# Altium schematic sheet Display_4DLCD-35480320-IPS.SchDoc
size A4; SheetNumber: 6; SheetTotal: 6
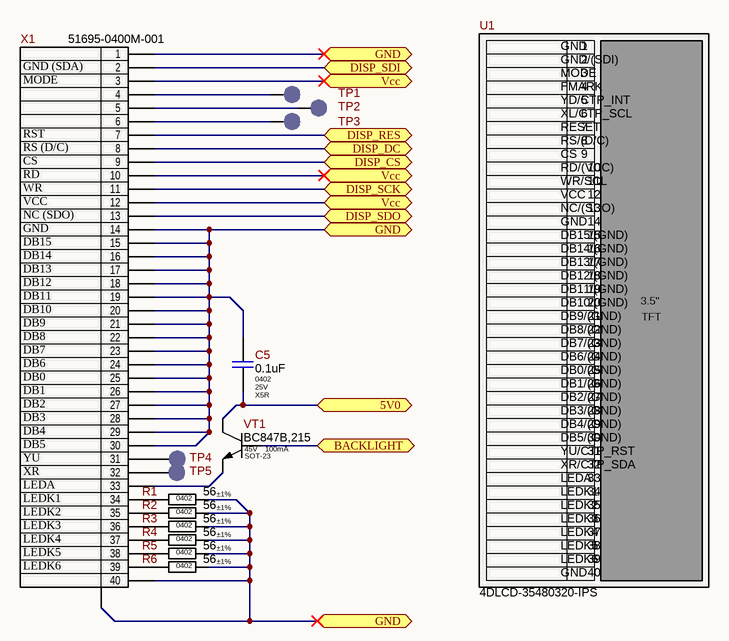
[diagram p0: Display_4DLCD-35480320-IPS.SchDoc]

## Parts
C5  Package: 0402  Voltage: 25V  Dielectric Type: X5R  [C_CERAMIC_0402_HI]  (hidden comment: 0.1uF)
R1  Tolerance: ±1%  Package: 0402  [R_ANY_CHIP_0402_MED]  (hidden comment: 56)
R2  Tolerance: ±1%  Package: 0402  [R_ANY_CHIP_0402_MED]  (hidden comment: 56)
R3  Tolerance: ±1%  Package: 0402  [R_ANY_CHIP_0402_MED]  (hidden comment: 56)
R4  Tolerance: ±1%  Package: 0402  [R_ANY_CHIP_0402_MED]  (hidden comment: 56)
R5  Tolerance: ±1%  Package: 0402  [R_ANY_CHIP_0402_MED]  (hidden comment: 56)
R6  Tolerance: ±1%  Package: 0402  [R_ANY_CHIP_0402_MED]  (hidden comment: 56)
TP1  LED_LINK  [TP_SMD_2mm]  (value not drawn)  (no BOM)
TP2  LED_LINK  [TP_SMD_2mm]  (value not drawn)  (no BOM)
TP3  LED_LINK  [TP_SMD_2mm]  (value not drawn)  (no BOM)
TP4  LED_LINK  [TP_SMD_2mm]  (value not drawn)  (no BOM)
TP5  LED_LINK  [TP_SMD_2mm]  (value not drawn)  (no BOM)
U1  4DLCD-35480320-IPS  [Dummy]
VT1  Ic: 100mA  Vce: 45V  Package: SOT-23  [SOT-23_HI]  (hidden comment: BC847B)
X1  51695-0400M-001  [51695-040-0M-001]

## Ports
5V0 (bidir, see UI[5C], DC-DC_5V0_To_3V3[2B], DC-DC_24V_To_5V0[4B]), BACKLIGHT (bidir, see UI[4D]), DISP_CS (bidir, see UI[5C]), DISP_DC (bidir, see UI[4C]), DISP_RES (bidir, see UI[4D]), DISP_SCK (bidir, see UI[4C]), DISP_SDI (bidir, see UI[4C]), DISP_SDO (bidir, see UI[4C]), GND (bidir, see UI[4D], DC-DC_5V0_To_3V3[2C], DC-DC_24V_To_5V0[1C], MCU_STM32L010K4T6[3B], MCU_STM32L010K4T6[4B]), Vcc (bidir, see UI[4C])

## Nets
5V0: C5.1 VT1.3(C) ; port 5V0
BACKLIGHT: VT1.1(B) ; port BACKLIGHT
DISP_CS: X1.9 ; port DISP_CS
DISP_DC: X1.8 ; port DISP_DC
DISP_RES: X1.7 ; port DISP_RES
DISP_SCK: X1.11 ; port DISP_SCK
DISP_SDI: X1.2 ; port DISP_SDI
DISP_SDO: X1.13 ; port DISP_SDO
GND: C5.2 R1.2 R2.2 R3.2 R4.2 R5.2 R6.2 X1.1 X1.14 X1.15 X1.16 X1.17 X1.18 X1.19 X1.20 X1.21 X1.22 X1.23 X1.24 X1.25 X1.26 X1.27 X1.28 X1.29 X1.30 X1.40 X1.MP(MountPad) ; port GND
Vcc: X1.3 X1.10 X1.12 ; port Vcc
NetR1_1: R1.1 X1.34
NetR2_1: R2.1 X1.35
NetR3_1: R3.1 X1.36
NetR4_1: R4.1 X1.37
NetR5_1: R5.1 X1.38
NetR6_1: R6.1 X1.39
NetTP1_1: TP1.1 X1.4
NetTP2_1: TP2.1 X1.5
NetTP3_1: TP3.1 X1.6
NetTP4_1: TP4.1 X1.31
NetTP5_1: TP5.1 X1.32
NetVT1_2: VT1.2(E) X1.33

## Notes on the sheet
- (near X1) GND (SDA)
- MODE
- RST
- (near X1) RS (D/C)
- CS
- RD
- WR
- VCC
- (near X1) NC (SDO)
- GND
- DB15
- DB14
- DB13
- DB12
- DB11
- DB10
- DB9
- DB8
- DB7
- DB6
- DB0
- DB1
- DB2
- DB3
- DB4
- DB5
- YU
- LEDA
- (near X1) LEDK1
- (near X1) LEDK2
- XR
- (near X1) LEDK3
- (near X1) LEDK4
- (near X1) LEDK5
- (near X1) LEDK6
- (in symbol 4DLCD-35480320-IPS) GND; 1; GND/(SDI); 2; MODE; 3; FMARK; 4; YD/CTP_INT; 5; XL/CTP_SCL; 6; RESET; 7; RS/(D/C); 8; CS; 9; RD/(VCC); 10; WR/SCL; 11; VCC; 12; NC/(SDO); 13; 14; DB15/(GND); 15; DB14/(GND); 16; DB13/(GND); 17; DB12/(GND); 18; DB11/(GND); 19; 3.5"; DB10/(GND); 20; TFT; DB9/(GND); 21; DB8/(GND); 22; DB7/(GND); 23; DB6/(GND); 24; DB0/(GND); 25; DB1/(GND); 26; DB2/(GND); 27; DB3/(GND); 28; DB4/(GND); 29; DB5/(GND); 30; YU/CTP_RST; 31; XR/CTP_SDA; 32; LEDA; 33; LEDK1; 34; LEDK2; 35; LEDK3; 36; LEDK4; 37; LEDK5; 38; LEDK6; 39; 40

## Library data of the parts
C5 = CL05A104KA5NNNC: 100nF 25V X5R ±10% 0402 Ceramic Capacitor RoHS; Manufacturer: Samsung Electro-Mechanics; Standard Lead Time: 38 Weeks; Replacement: NONE; Component Status: Released; Value: 0.1uF; Part Number: CL05A104KA5NNNC; Part Type: Ceramic / X5R / 0402; Component Type: SMD; Temperature Range: -55°C ~ 85°C; Tolerance: ±10%; ComponentLink1URL: https://eu.mouser.com/datasheet/2/585/MLCC-1837944.pdf; Supplier 1: Mouser; Supplier Part Number 1: 187-CL05A104KA5NNNC; ComponentLink1Description: Datasheet; Price: 0.0013
R1-R6 = Resistor: 56 Ohms ±1% 1/16W 0402 Thick Film Resistor; Part Number: RC0402FR-0756RL; Manufacturer: Yageo; Power Rating: 0.062W; Voltage: 50V; Component Status: Review; Temperature Stability: ±100ppm/°C; Replacement: NONE; Value: 56; Component Type: SMD; Part Type: Thick Film; Temperature Range: -55°C ~ 155°C; ComponentLink1URL: https://eu.mouser.com/datasheet/2/447/PYu_RC_Group_51_RoHS_L_11-1984063.pdf; Supplier 1: Digi-Key; Supplier Part Number 1: 311-56.0LRTR-ND; Price: NONE; ComponentLink1Description: Datasheet
TP1-TP5 = Test-Point-SMD-1: Test Point SMD Pad 1.0mm/1.5mm/2mm; Part Number: TP-PAD-SMD; Replacement: NONE; Part Type: Test Point; Component Type: SMD; Temperature Range: NONE; ComponentLink1URL: NONE; ComponentLink1Description: Datasheet
U1 = 4DLCD-35480320-IPS: 3.5 Inch TFT LCD Module, 320x480, IPS MCU, 16-bit/SPI; Manufacturer: 4D LCD; Component Status: Review_1; Replacement: NONE; Part Number: 4DLCD-35480320-IPS; Part Type: LCD / Panel; ComponentLink1URL: https://resources.4dsystems.com.au/datasheets/4dlcd/4DLCD-35480320-IPS/4DLCD-35480320-IPS_Series_Datasheet_R_1_3.pdf; Price: NONE; ComponentLink1Description: Datasheet
VT1 = BC847B,215: 45V, 100mA NPN General Purpose Transistor; Manufacturer: Nexperia USA; Component Status: Released; Standard Lead Time: 4 Weeks; Replacement: NONE; Part Number: BC847B,215; Part Type: NPN; Component Type: SMD; Temperature Range: -65°C ~ 150°C; ComponentLink1URL: https://assets.nexperia.com/documents/data-sheet/BC847_SER.pdf; Supplier 1: Digi-Key; Supplier Part Number 1: 1727-2921-2-ND; Price: 0.02426013; ComponentLink1Description: Datasheet
X1 = 51695-0400M-001: 40 pin FFC/FPC Connector, 0.50mm Pitch, 51695 Series, Right-Angle, Bottom Contact, 1.23mm Height, SMD; Manufacturer: Aces Electronics; Replacement: NONE; Part Number: 51695-0400M-001; Part Type: FFC/FPC; Component Type: SMD; Temperature Range: -40°C ~ 85°C; Price: NONE